# EasyEDA Pro project FaderBay.eprj

# Schematic Schematic1

## Sheets
1 P1: Board Name: Board1; Create Date: 2025-02-10; Page Name: P1; Project Name: FaderBay; Schematic Name: Schematic1; Update Date: 2025-02-10; Company: EasyEDA.com; Page Size: A4; Version: V1.0
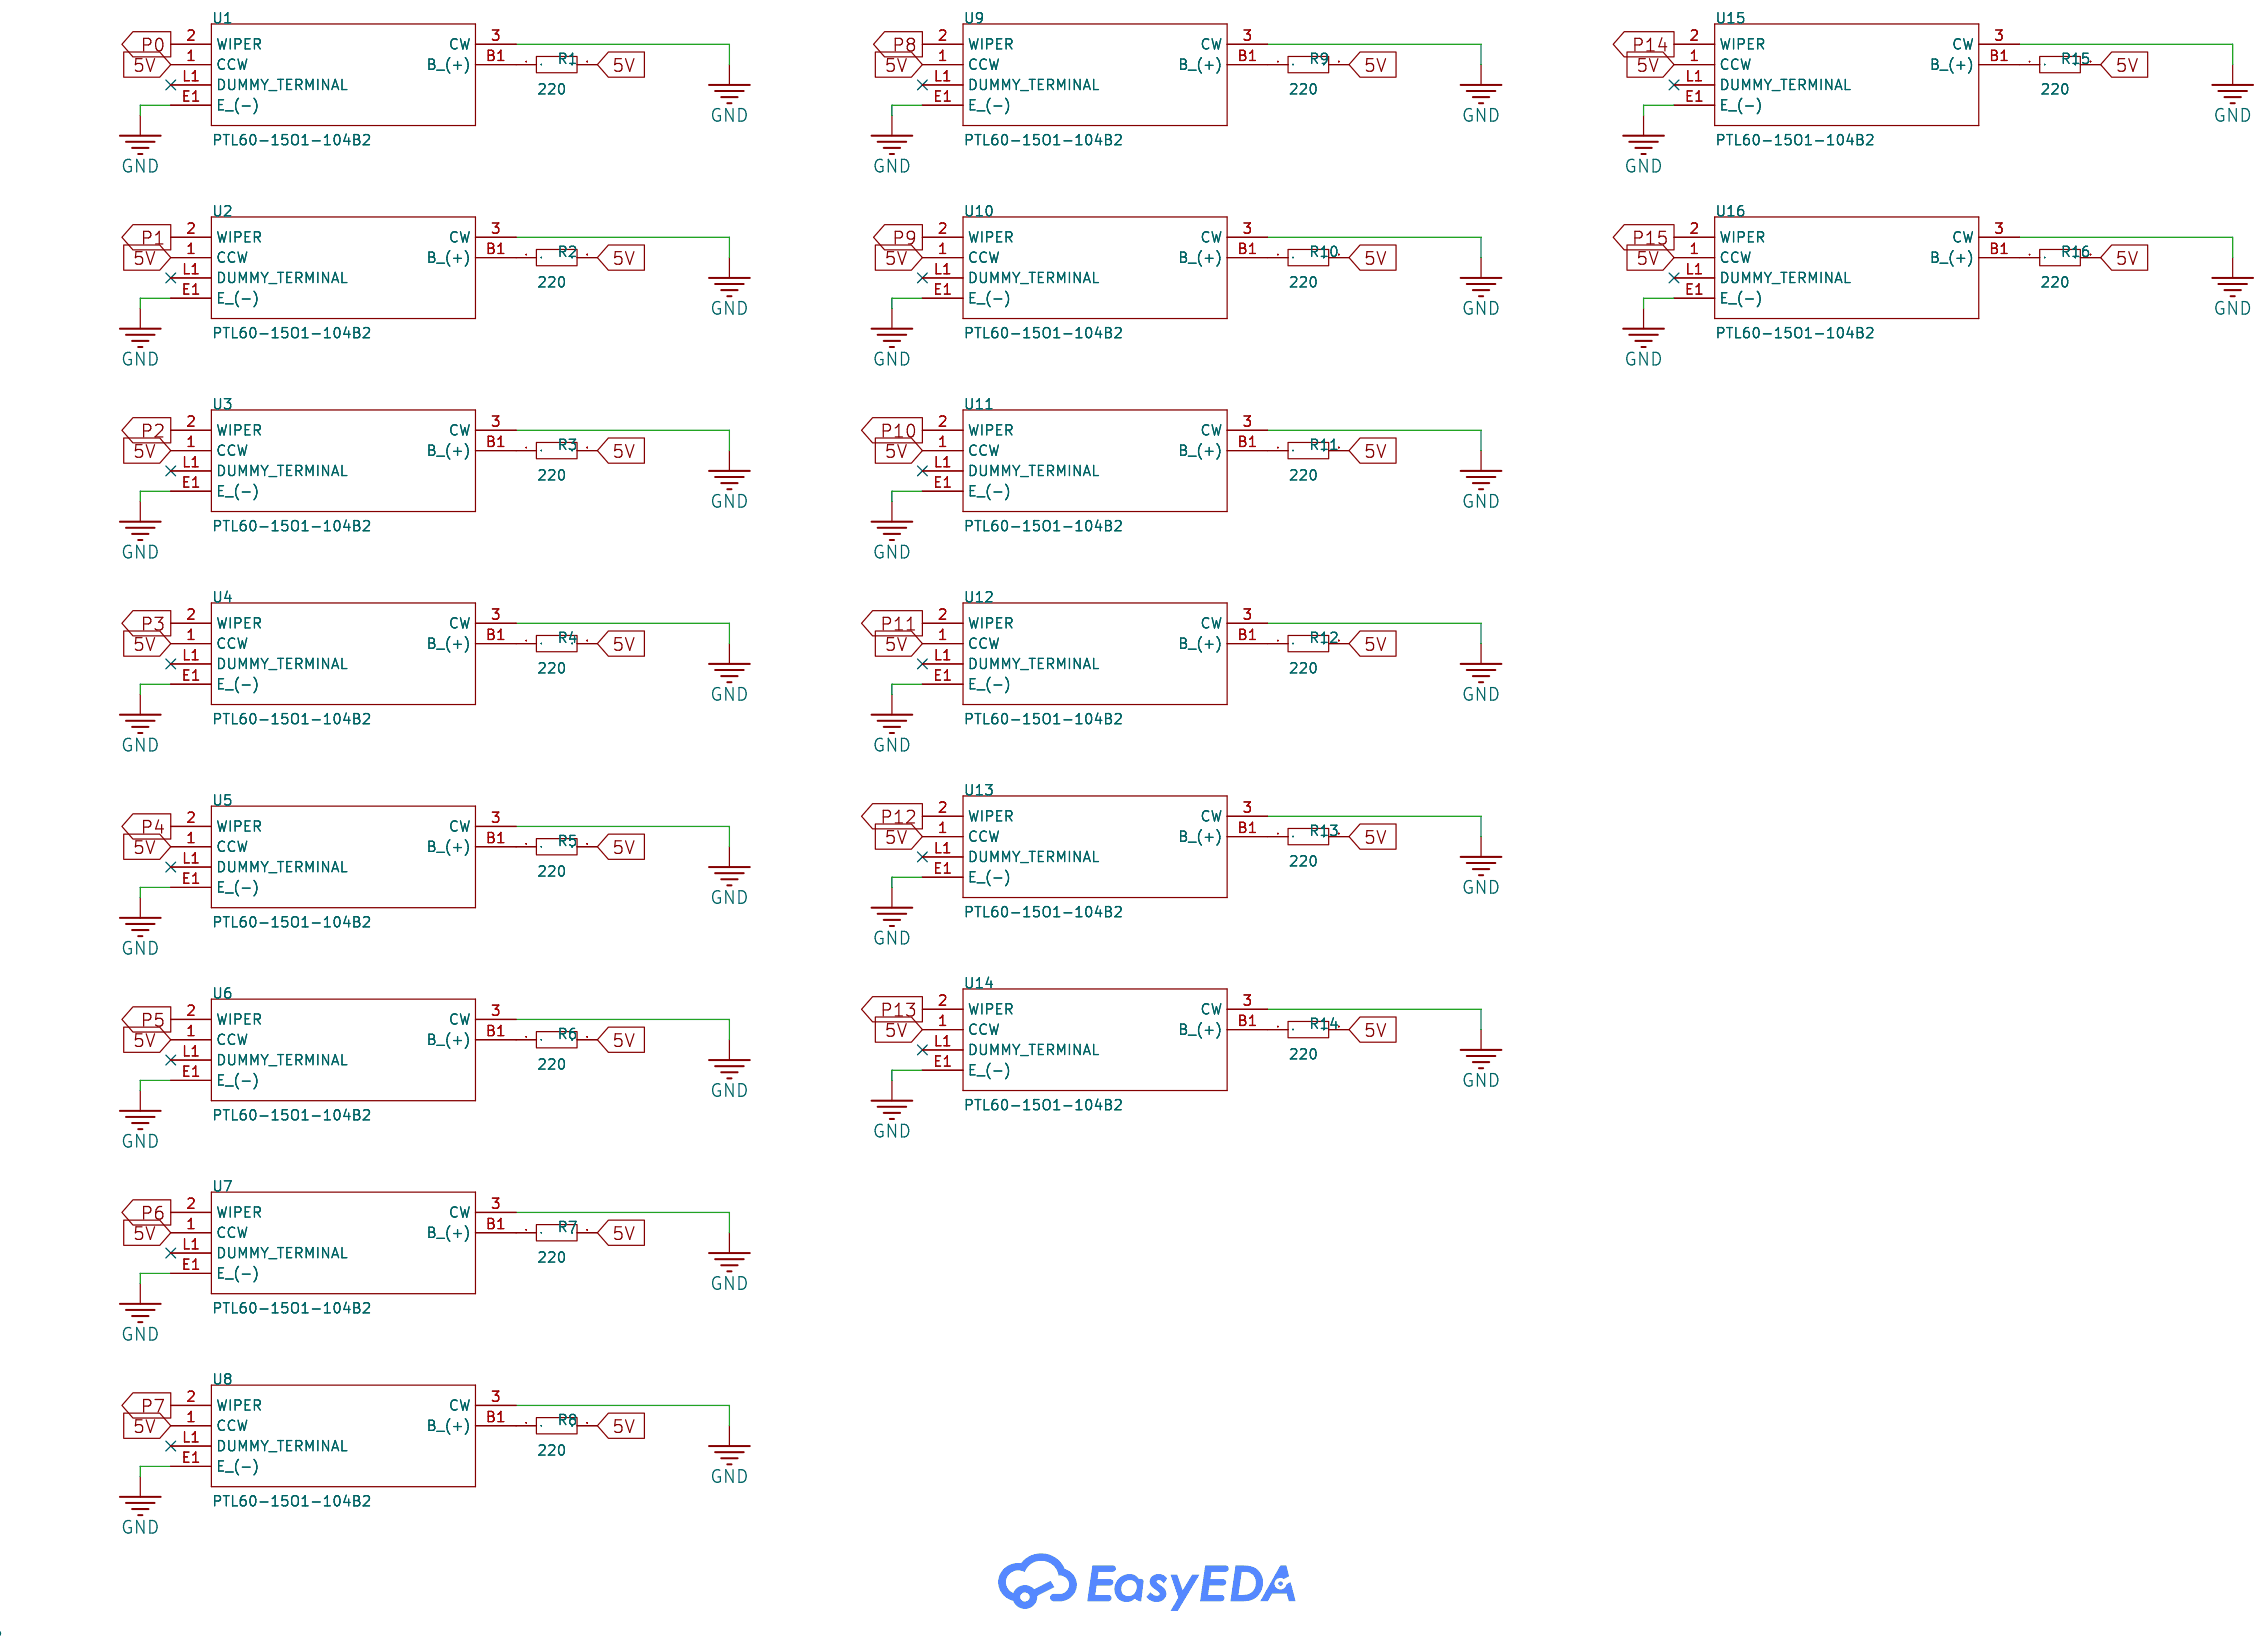
[diagram p0: P1]
2 P2: Page Name: P2
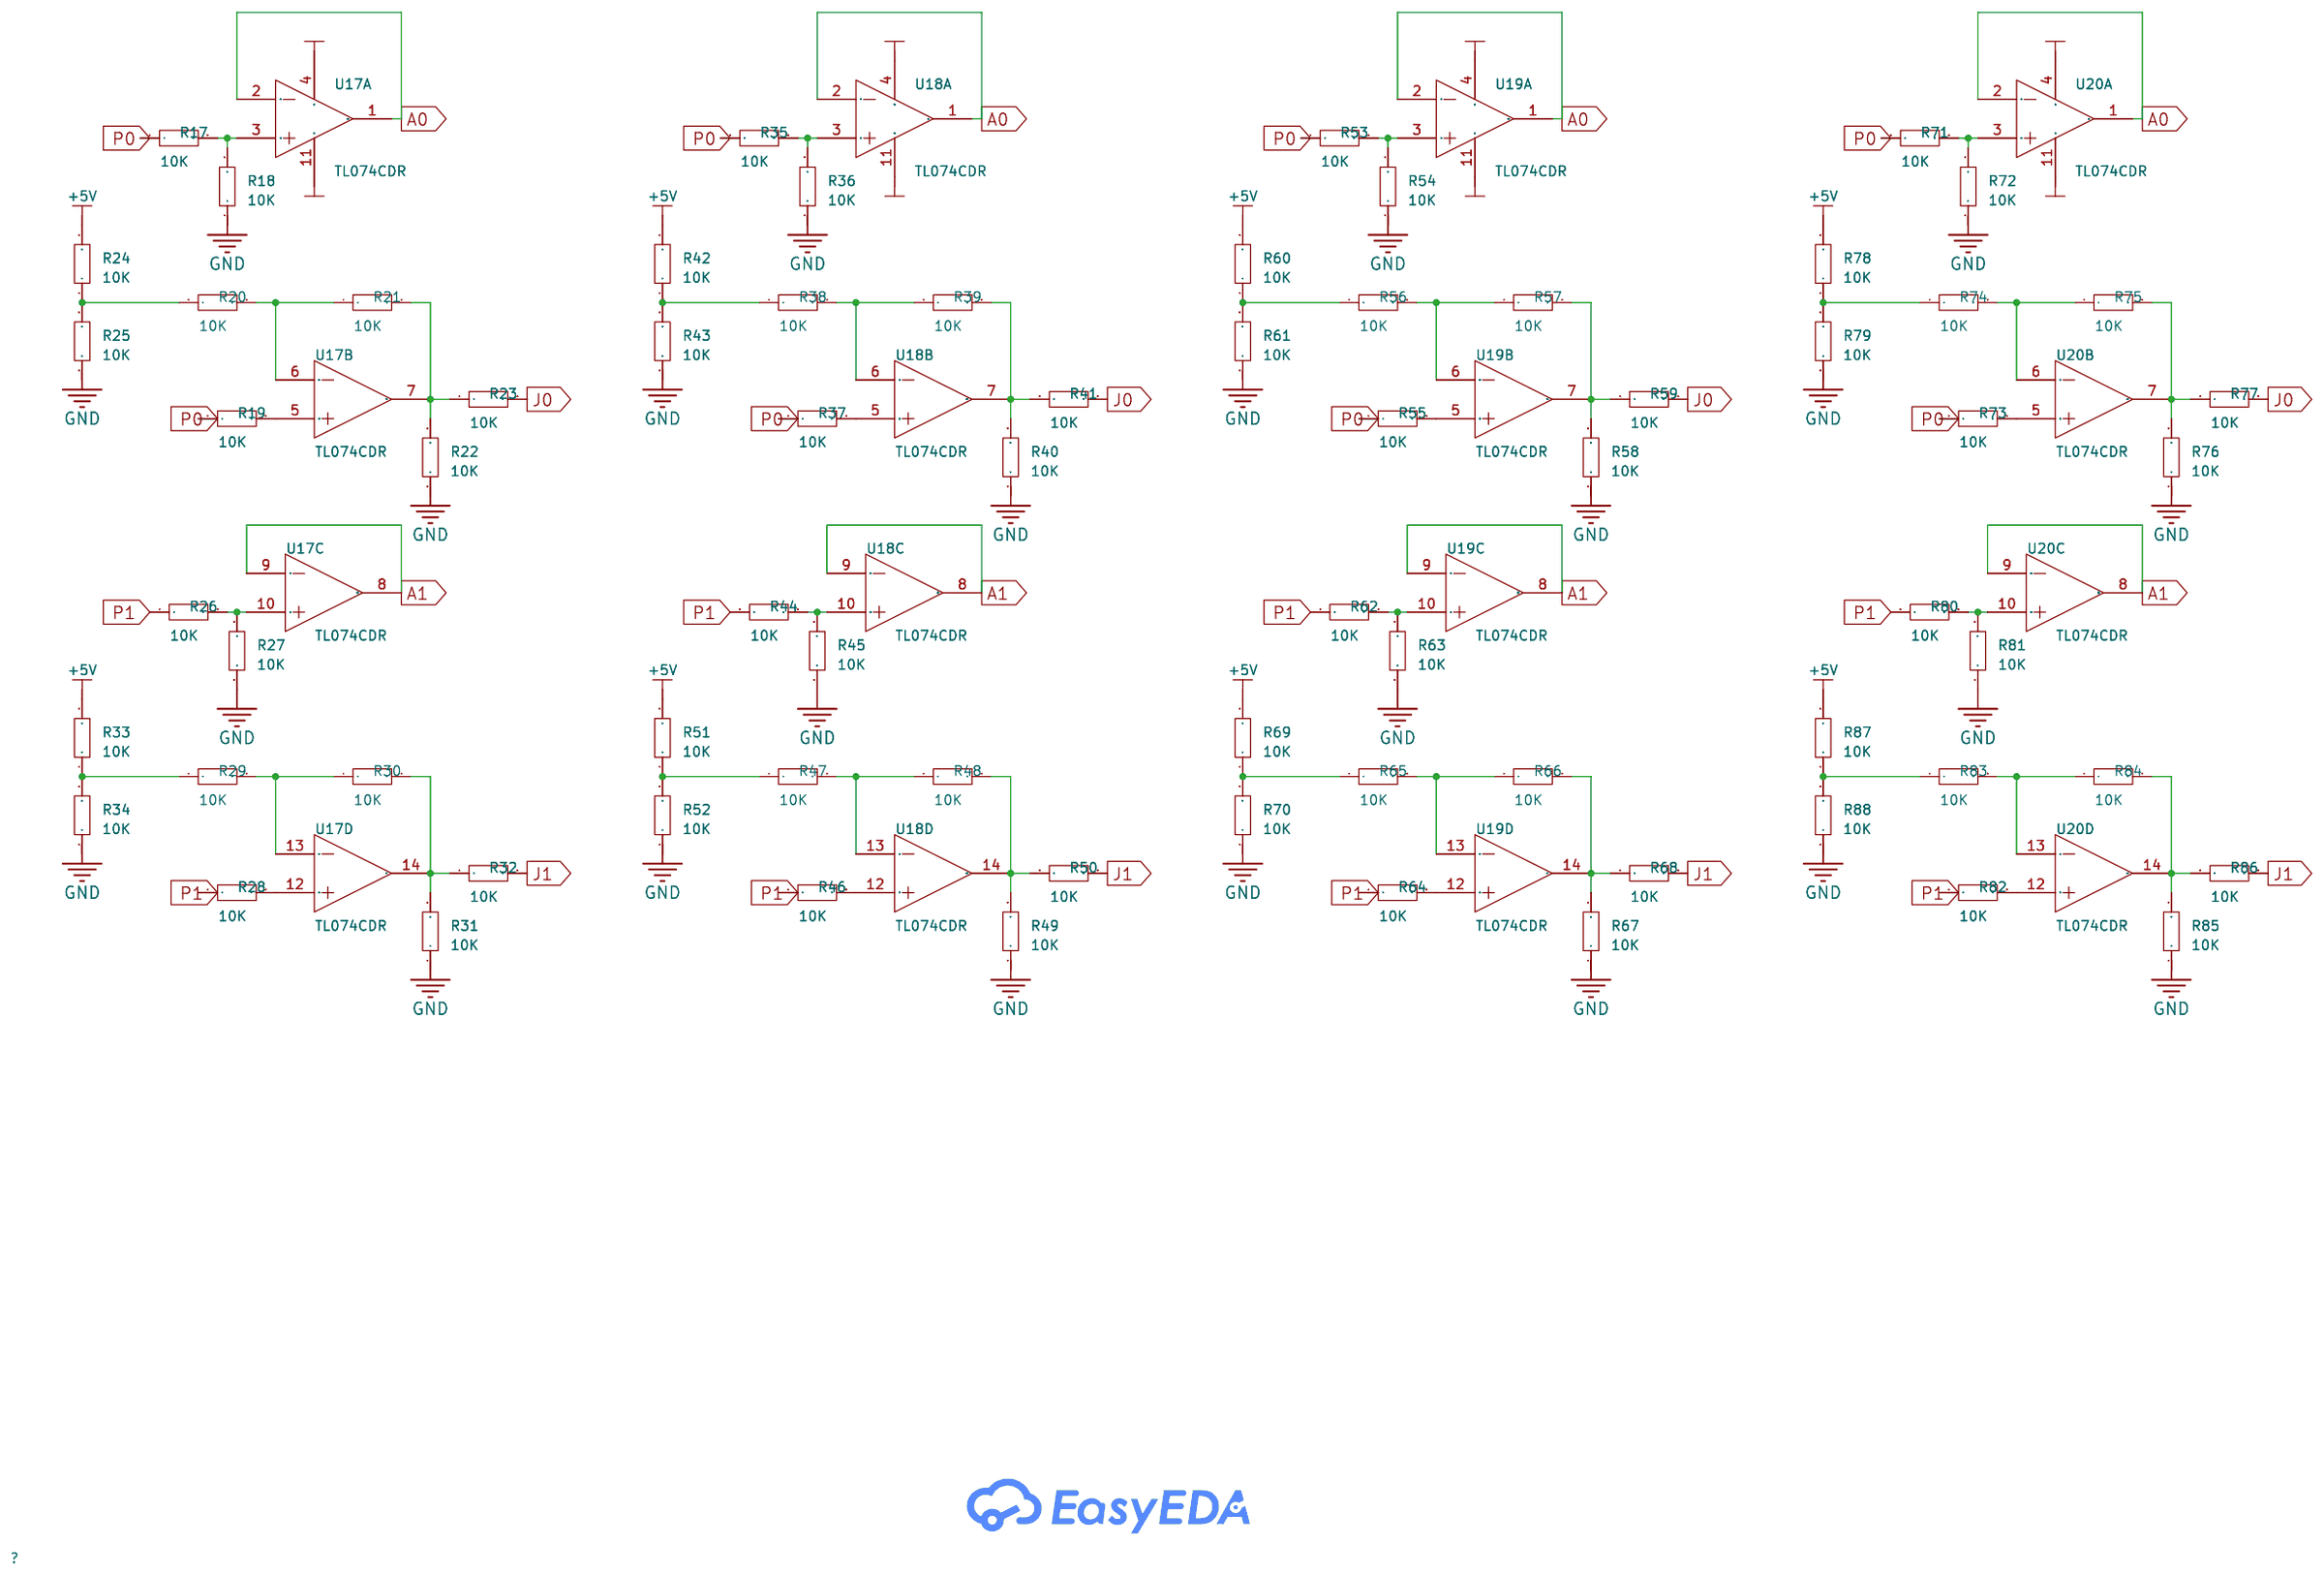
[diagram p1: P2]
3 P3: Page Name: P2
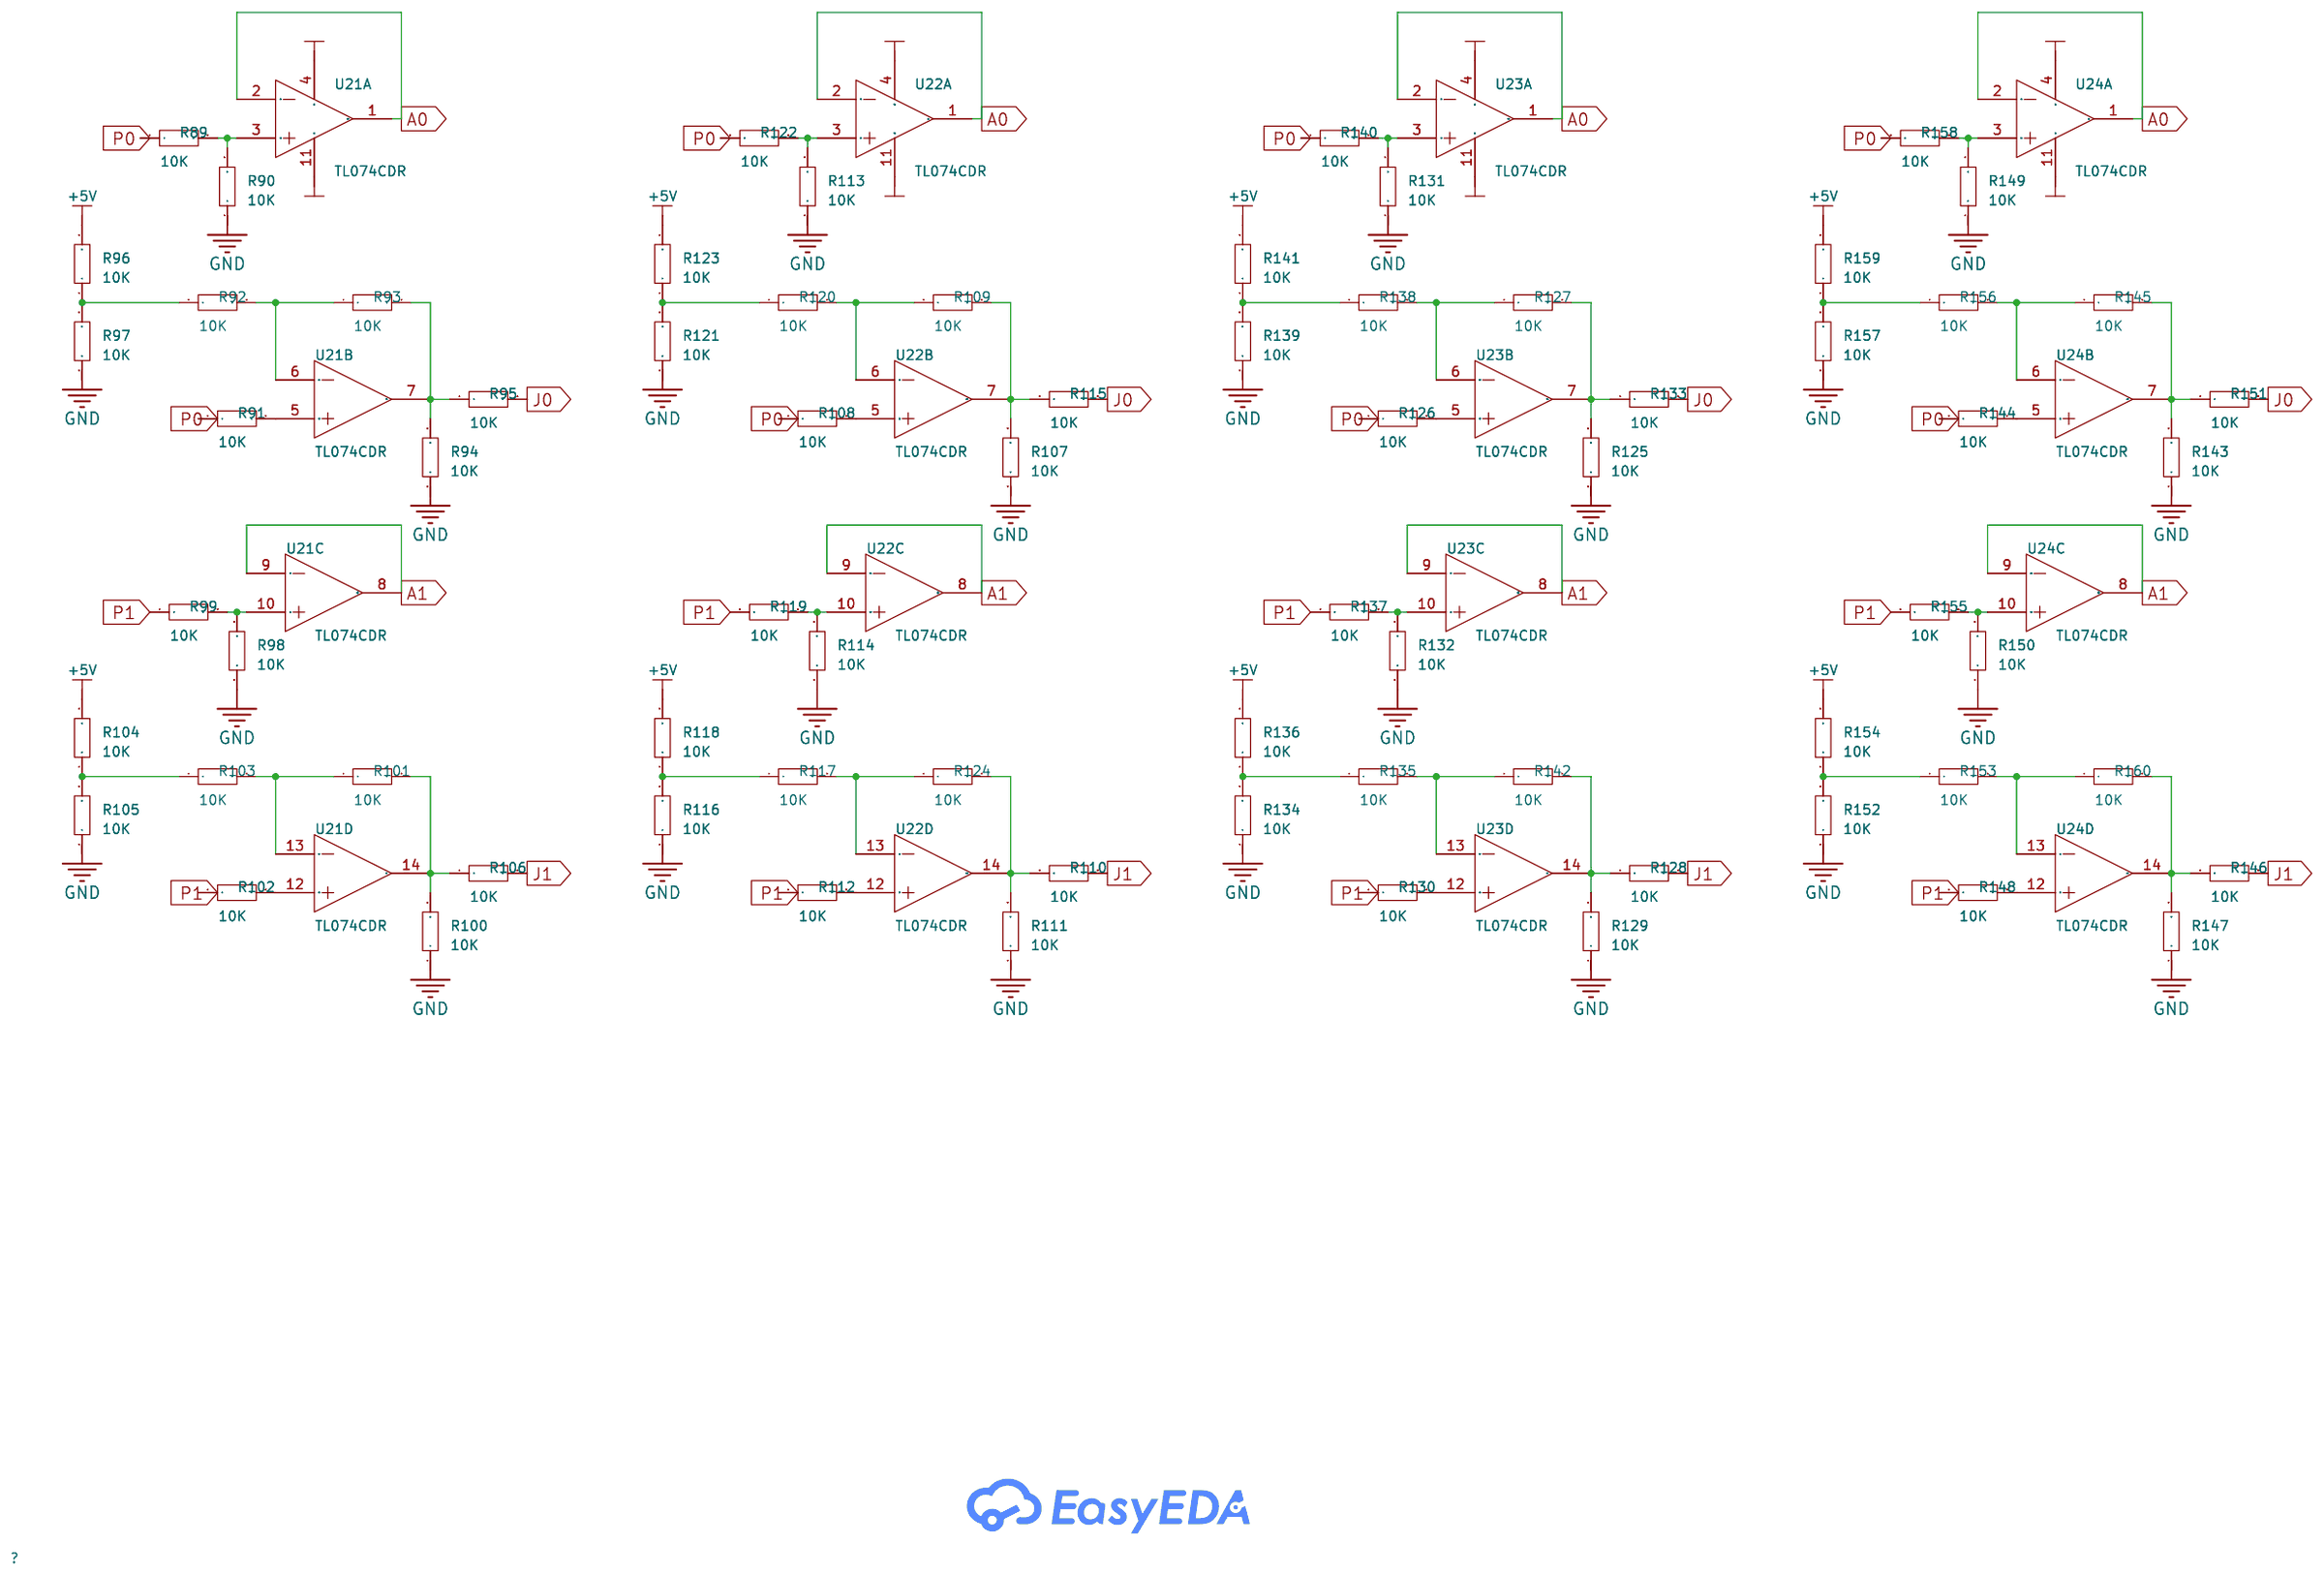
[diagram p2: P3]

## Parts
sheet P1
R1  220  [R0603]
R2  220  [R0603]
R3  220  [R0603]
R4  220  [R0603]
R5  220  [R0603]
R6  220  [R0603]
R7  220  [R0603]
R8  220  [R0603]
R9  220  [R0603]
R10  220  [R0603]
R11  220  [R0603]
R12  220  [R0603]
R13  220  [R0603]
R14  220  [R0603]
R15  220  [R0603]
R16  220  [R0603]
U1  PTL60-15O1-104B2  [PTL6015O1104B2]
U2  PTL60-15O1-104B2  [PTL6015O1104B2]
U3  PTL60-15O1-104B2  [PTL6015O1104B2]
U4  PTL60-15O1-104B2  [PTL6015O1104B2]
U5  PTL60-15O1-104B2  [PTL6015O1104B2]
U6  PTL60-15O1-104B2  [PTL6015O1104B2]
U7  PTL60-15O1-104B2  [PTL6015O1104B2]
U8  PTL60-15O1-104B2  [PTL6015O1104B2]
U9  PTL60-15O1-104B2  [PTL6015O1104B2]
U10  PTL60-15O1-104B2  [PTL6015O1104B2]
U11  PTL60-15O1-104B2  [PTL6015O1104B2]
U12  PTL60-15O1-104B2  [PTL6015O1104B2]
U13  PTL60-15O1-104B2  [PTL6015O1104B2]
U14  PTL60-15O1-104B2  [PTL6015O1104B2]
U15  PTL60-15O1-104B2  [PTL6015O1104B2]
U16  PTL60-15O1-104B2  [PTL6015O1104B2]
sheet P2
R17  10K  [R0603]
R18  10K  [R0603]
R19  10K  [R0603]
R20  10K  [R0603]
R21  10K  [R0603]
R22  10K  [R0603]
R23  10K  [R0603]
R24  10K  [R0603]
R25  10K  [R0603]
R26  10K  [R0603]
R27  10K  [R0603]
R28  10K  [R0603]
R29  10K  [R0603]
R30  10K  [R0603]
R31  10K  [R0603]
R32  10K  [R0603]
R33  10K  [R0603]
R34  10K  [R0603]
R35  10K  [R0603]
R36  10K  [R0603]
R37  10K  [R0603]
R38  10K  [R0603]
R39  10K  [R0603]
R40  10K  [R0603]
R41  10K  [R0603]
R42  10K  [R0603]
R43  10K  [R0603]
R44  10K  [R0603]
R45  10K  [R0603]
R46  10K  [R0603]
R47  10K  [R0603]
R48  10K  [R0603]
R49  10K  [R0603]
R50  10K  [R0603]
R51  10K  [R0603]
R52  10K  [R0603]
R53  10K  [R0603]
R54  10K  [R0603]
R55  10K  [R0603]
R56  10K  [R0603]
R57  10K  [R0603]
R58  10K  [R0603]
R59  10K  [R0603]
R60  10K  [R0603]
R61  10K  [R0603]
R62  10K  [R0603]
R63  10K  [R0603]
R64  10K  [R0603]
R65  10K  [R0603]
R66  10K  [R0603]
R67  10K  [R0603]
R68  10K  [R0603]
R69  10K  [R0603]
R70  10K  [R0603]
R71  10K  [R0603]
R72  10K  [R0603]
R73  10K  [R0603]
R74  10K  [R0603]
R75  10K  [R0603]
R76  10K  [R0603]
R77  10K  [R0603]
R78  10K  [R0603]
R79  10K  [R0603]
R80  10K  [R0603]
R81  10K  [R0603]
R82  10K  [R0603]
R83  10K  [R0603]
R84  10K  [R0603]
R85  10K  [R0603]
R86  10K  [R0603]
R87  10K  [R0603]
R88  10K  [R0603]
U17  TL074CDR  [SOIC-14_L8.7-W3.9-P1.27-LS6.0-BL]  (sections 1,2,3,4)
U18  TL074CDR  [SOIC-14_L8.7-W3.9-P1.27-LS6.0-BL]  (sections 1,2,3,4)
U19  TL074CDR  [SOIC-14_L8.7-W3.9-P1.27-LS6.0-BL]  (sections 1,2,3,4)
U20  TL074CDR  [SOIC-14_L8.7-W3.9-P1.27-LS6.0-BL]  (sections 1,2,3,4)
sheet P3
R89  10K  [R0603]
R90  10K  [R0603]
R91  10K  [R0603]
R92  10K  [R0603]
R93  10K  [R0603]
R94  10K  [R0603]
R95  10K  [R0603]
R96  10K  [R0603]
R97  10K  [R0603]
R98  10K  [R0603]
R99  10K  [R0603]
R100  10K  [R0603]
R101  10K  [R0603]
R102  10K  [R0603]
R103  10K  [R0603]
R104  10K  [R0603]
R105  10K  [R0603]
R106  10K  [R0603]
R107  10K  [R0603]
R108  10K  [R0603]
R109  10K  [R0603]
R110  10K  [R0603]
R111  10K  [R0603]
R112  10K  [R0603]
R113  10K  [R0603]
R114  10K  [R0603]
R115  10K  [R0603]
R116  10K  [R0603]
R117  10K  [R0603]
R118  10K  [R0603]
R119  10K  [R0603]
R120  10K  [R0603]
R121  10K  [R0603]
R122  10K  [R0603]
R123  10K  [R0603]
R124  10K  [R0603]
R125  10K  [R0603]
R126  10K  [R0603]
R127  10K  [R0603]
R128  10K  [R0603]
R129  10K  [R0603]
R130  10K  [R0603]
R131  10K  [R0603]
R132  10K  [R0603]
R133  10K  [R0603]
R134  10K  [R0603]
R135  10K  [R0603]
R136  10K  [R0603]
R137  10K  [R0603]
R138  10K  [R0603]
R139  10K  [R0603]
R140  10K  [R0603]
R141  10K  [R0603]
R142  10K  [R0603]
R143  10K  [R0603]
R144  10K  [R0603]
R145  10K  [R0603]
R146  10K  [R0603]
R147  10K  [R0603]
R148  10K  [R0603]
R149  10K  [R0603]
R150  10K  [R0603]
R151  10K  [R0603]
R152  10K  [R0603]
R153  10K  [R0603]
R154  10K  [R0603]
R155  10K  [R0603]
R156  10K  [R0603]
R157  10K  [R0603]
R158  10K  [R0603]
R159  10K  [R0603]
R160  10K  [R0603]
U21  TL074CDR  [SOIC-14_L8.7-W3.9-P1.27-LS6.0-BL]  (sections 1,2,3,4)
U22  TL074CDR  [SOIC-14_L8.7-W3.9-P1.27-LS6.0-BL]  (sections 1,2,3,4)
U23  TL074CDR  [SOIC-14_L8.7-W3.9-P1.27-LS6.0-BL]  (sections 1,2,3,4)
U24  TL074CDR  [SOIC-14_L8.7-W3.9-P1.27-LS6.0-BL]  (sections 1,2,3,4)

## Library data of the parts
R1-R160 = Res_0603: Supplier Footprint: 0603
U1-U16 = PTL60-15O1-104B2
U17-U24 = TL074CDR: Supplier Part: C12594; Manufacturer: TI(德州仪器); Supplier Footprint: SOIC-14; JLCPCB Part Class: Extended Part; Datasheet: https://www.ti.com/cn/lit/gpn/tl074; Supplier: LCSC; Gain Bandwidth Product(GBP): 5.25MHz; Current - Input Bias(Ib): 65pA; Voltage - Input Offset(Vos): 3mV; Slew Rate(SR): 13V/us; Supply Current Per Channel: 1.4mA; Operating Temperature: 0℃~+70℃

## Nets
5V: R1.2 R2.2 R3.2 R4.2 R5.2 R6.2 R7.2 R8.2 R9.2 R10.2 R11.2 R12.2 R13.2 R14.2 R15.2 R16.2 U1.1(CCW) U2.1(CCW) U3.1(CCW) U4.1(CCW) U5.1(CCW) U6.1(CCW) U7.1(CCW) U8.1(CCW) U9.1(CCW) U10.1(CCW) U11.1(CCW) U12.1(CCW) U13.1(CCW) U14.1(CCW) U15.1(CCW) U16.1(CCW)
+5V: R24.2 R33.2 R42.2 R51.2 R60.2 R69.2 R78.2 R87.2 R96.2 R104.2 R118.2 R123.2 R136.2 R141.2 R154.2 R159.2
+12V: U17.4(VCC+) U18.4(VCC+) U19.4(VCC+) U20.4(VCC+) U21.4(VCC+) U22.4(VCC+) U23.4(VCC+) U24.4(VCC+)
-12V: U17.11(VCC-) U18.11(VCC-) U19.11(VCC-) U20.11(VCC-) U21.11(VCC-) U22.11(VCC-) U23.11(VCC-) U24.11(VCC-)
GND: R18.1 R22.1 R25.1 R27.1 R31.1 R34.1 R36.1 R40.1 R43.1 R45.1 R49.1 R52.1 R54.1 R58.1 R61.1 R63.1 R67.1 R70.1 R72.1 R76.1 R79.1 R81.1 R85.1 R88.1 R90.1 R94.1 R97.1 R98.1 R100.1 R105.1 R107.1 R111.1 R113.1 R114.1 R116.1 R121.1 R125.1 R129.1 R131.1 R132.1 R134.1 R139.1 R143.1 R147.1 R149.1 R150.1 R152.1 R157.1 U1.3(CW) U1.E1(E_(-)) U2.3(CW) U2.E1(E_(-)) U3.3(CW) U3.E1(E_(-)) U4.3(CW) U4.E1(E_(-)) U5.3(CW) U5.E1(E_(-)) U6.3(CW) U6.E1(E_(-)) U7.3(CW) U7.E1(E_(-)) U8.3(CW) U8.E1(E_(-)) U9.3(CW) U9.E1(E_(-)) U10.3(CW) U10.E1(E_(-)) U11.3(CW) U11.E1(E_(-)) U12.3(CW) U12.E1(E_(-)) U13.3(CW) U13.E1(E_(-)) U14.3(CW) U14.E1(E_(-)) U15.3(CW) U15.E1(E_(-)) U16.3(CW) U16.E1(E_(-))
A0: U17.1(OUT1) U17.2(IN1-) U18.1(OUT1) U18.2(IN1-) U19.1(OUT1) U19.2(IN1-) U20.1(OUT1) U20.2(IN1-) U21.1(OUT1) U21.2(IN1-) U22.1(OUT1) U22.2(IN1-) U23.1(OUT1) U23.2(IN1-) U24.1(OUT1) U24.2(IN1-)
A1: U17.8(OUT3) U17.9(IN3-) U18.8(OUT3) U18.9(IN3-) U19.8(OUT3) U19.9(IN3-) U20.8(OUT3) U20.9(IN3-) U21.8(OUT3) U21.9(IN3-) U22.8(OUT3) U22.9(IN3-) U23.8(OUT3) U23.9(IN3-) U24.8(OUT3) U24.9(IN3-)
J0: R23.2 R41.2 R59.2 R77.2 R95.2 R115.2 R133.2 R151.2
J1: R32.2 R50.2 R68.2 R86.2 R106.2 R110.2 R128.2 R146.2
P0: R17.1 R19.1 R35.1 R37.1 R53.1 R55.1 R71.1 R73.1 R89.1 R91.1 R108.1 R122.1 R126.1 R140.1 R144.1 R158.1 U1.2(WIPER)
P1: R26.1 R28.1 R44.1 R46.1 R62.1 R64.1 R80.1 R82.1 R99.1 R102.1 R112.1 R119.1 R130.1 R137.1 R148.1 R155.1 U2.2(WIPER)
P2: U3.2(WIPER)
P3: U4.2(WIPER)
P4: U5.2(WIPER)
P5: U6.2(WIPER)
P6: U7.2(WIPER)
P7: U8.2(WIPER)
P8: U9.2(WIPER)
P9: U10.2(WIPER)
P10: U11.2(WIPER)
P11: U12.2(WIPER)
P12: U13.2(WIPER)
P13: U14.2(WIPER)
P14: U15.2(WIPER)
P15: U16.2(WIPER)
Net-(R1-1): R1.1 U1.B1(B_(+))
Net-(R2-1): R2.1 U2.B1(B_(+))
Net-(R3-1): R3.1 U3.B1(B_(+))
Net-(R4-1): R4.1 U4.B1(B_(+))
Net-(R5-1): R5.1 U5.B1(B_(+))
Net-(R6-1): R6.1 U6.B1(B_(+))
Net-(R7-1): R7.1 U7.B1(B_(+))
Net-(R8-1): R8.1 U8.B1(B_(+))
Net-(R9-1): R9.1 U9.B1(B_(+))
Net-(R10-1): R10.1 U10.B1(B_(+))
Net-(R11-1): R11.1 U11.B1(B_(+))
Net-(R12-1): R12.1 U12.B1(B_(+))
Net-(R13-1): R13.1 U13.B1(B_(+))
Net-(R14-1): R14.1 U14.B1(B_(+))
Net-(R15-1): R15.1 U15.B1(B_(+))
Net-(R16-1): R16.1 U16.B1(B_(+))
Net-(R17-2): R17.2 R18.2 U17.3(IN1+)
Net-(R19-2): R19.2 U17.5(IN2+)
Net-(R20-1): R20.1 R24.1 R25.2
Net-(R20-2): R20.2 R21.1 U17.6(IN2-)
Net-(R21-2): R21.2 R22.2 R23.1 U17.7(OUT2)
Net-(R26-2): R26.2 R27.2 U17.10(IN3+)
Net-(R28-2): R28.2 U17.12(IN4+)
Net-(R29-1): R29.1 R33.1 R34.2
Net-(R29-2): R29.2 R30.1 U17.13(IN4-)
Net-(R30-2): R30.2 R31.2 R32.1 U17.14(OUT4)
Net-(R35-2): R35.2 R36.2 U18.3(IN1+)
Net-(R37-2): R37.2 U18.5(IN2+)
Net-(R38-1): R38.1 R42.1 R43.2
Net-(R38-2): R38.2 R39.1 U18.6(IN2-)
Net-(R39-2): R39.2 R40.2 R41.1 U18.7(OUT2)
Net-(R44-2): R44.2 R45.2 U18.10(IN3+)
Net-(R46-2): R46.2 U18.12(IN4+)
Net-(R47-1): R47.1 R51.1 R52.2
Net-(R47-2): R47.2 R48.1 U18.13(IN4-)
Net-(R48-2): R48.2 R49.2 R50.1 U18.14(OUT4)
Net-(R53-2): R53.2 R54.2 U19.3(IN1+)
Net-(R55-2): R55.2 U19.5(IN2+)
Net-(R56-1): R56.1 R60.1 R61.2
Net-(R56-2): R56.2 R57.1 U19.6(IN2-)
Net-(R57-2): R57.2 R58.2 R59.1 U19.7(OUT2)
Net-(R62-2): R62.2 R63.2 U19.10(IN3+)
Net-(R64-2): R64.2 U19.12(IN4+)
Net-(R65-1): R65.1 R69.1 R70.2
Net-(R65-2): R65.2 R66.1 U19.13(IN4-)
Net-(R66-2): R66.2 R67.2 R68.1 U19.14(OUT4)
Net-(R71-2): R71.2 R72.2 U20.3(IN1+)
Net-(R73-2): R73.2 U20.5(IN2+)
Net-(R74-1): R74.1 R78.1 R79.2
Net-(R74-2): R74.2 R75.1 U20.6(IN2-)
Net-(R75-2): R75.2 R76.2 R77.1 U20.7(OUT2)
Net-(R80-2): R80.2 R81.2 U20.10(IN3+)
Net-(R82-2): R82.2 U20.12(IN4+)
Net-(R83-1): R83.1 R87.1 R88.2
Net-(R83-2): R83.2 R84.1 U20.13(IN4-)
Net-(R84-2): R84.2 R85.2 R86.1 U20.14(OUT4)
Net-(R89-2): R89.2 R90.2 U21.3(IN1+)
Net-(R91-2): R91.2 U21.5(IN2+)
Net-(R92-1): R92.1 R96.1 R97.2
Net-(R92-2): R92.2 R93.1 U21.6(IN2-)
Net-(R93-2): R93.2 R94.2 R95.1 U21.7(OUT2)
Net-(R98-2): R98.2 R99.2 U21.10(IN3+)
Net-(R100-2): R100.2 R101.2 R106.1 U21.14(OUT4)
Net-(R101-1): R101.1 R103.2 U21.13(IN4-)
Net-(R102-2): R102.2 U21.12(IN4+)
Net-(R103-1): R103.1 R104.1 R105.2
Net-(R107-2): R107.2 R109.2 R115.1 U22.7(OUT2)
Net-(R108-2): R108.2 U22.5(IN2+)
Net-(R109-1): R109.1 R120.2 U22.6(IN2-)
Net-(R110-1): R110.1 R111.2 R124.2 U22.14(OUT4)
Net-(R112-2): R112.2 U22.12(IN4+)
Net-(R113-2): R113.2 R122.2 U22.3(IN1+)
Net-(R114-2): R114.2 R119.2 U22.10(IN3+)
Net-(R116-2): R116.2 R117.1 R118.1
Net-(R117-2): R117.2 R124.1 U22.13(IN4-)
Net-(R120-1): R120.1 R121.2 R123.1
Net-(R125-2): R125.2 R127.2 R133.1 U23.7(OUT2)
Net-(R126-2): R126.2 U23.5(IN2+)
Net-(R127-1): R127.1 R138.2 U23.6(IN2-)
Net-(R128-1): R128.1 R129.2 R142.2 U23.14(OUT4)
Net-(R130-2): R130.2 U23.12(IN4+)
Net-(R131-2): R131.2 R140.2 U23.3(IN1+)
Net-(R132-2): R132.2 R137.2 U23.10(IN3+)
Net-(R134-2): R134.2 R135.1 R136.1
Net-(R135-2): R135.2 R142.1 U23.13(IN4-)
Net-(R138-1): R138.1 R139.2 R141.1
Net-(R143-2): R143.2 R145.2 R151.1 U24.7(OUT2)
Net-(R144-2): R144.2 U24.5(IN2+)
Net-(R145-1): R145.1 R156.2 U24.6(IN2-)
Net-(R146-1): R146.1 R147.2 R160.2 U24.14(OUT4)
Net-(R148-2): R148.2 U24.12(IN4+)
Net-(R149-2): R149.2 R158.2 U24.3(IN1+)
Net-(R150-2): R150.2 R155.2 U24.10(IN3+)
Net-(R152-2): R152.2 R153.1 R154.1
Net-(R153-2): R153.2 R160.1 U24.13(IN4-)
Net-(R156-1): R156.1 R157.2 R159.1

Not connected (* = marked no-connect by the designer): U1 L1(DUMMY_TERMINAL)*; U2 L1(DUMMY_TERMINAL)*; U3 L1(DUMMY_TERMINAL)*; U4 L1(DUMMY_TERMINAL)*; U5 L1(DUMMY_TERMINAL)*; U6 L1(DUMMY_TERMINAL)*; U7 L1(DUMMY_TERMINAL)*; U8 L1(DUMMY_TERMINAL)*; U9 L1(DUMMY_TERMINAL)*; U10 L1(DUMMY_TERMINAL)*; U11 L1(DUMMY_TERMINAL)*; U12 L1(DUMMY_TERMINAL)*; U13 L1(DUMMY_TERMINAL)*; U14 L1(DUMMY_TERMINAL)*; U15 L1(DUMMY_TERMINAL)*; U16 L1(DUMMY_TERMINAL)*
